# EAGLE schematic UCirKitUserStudyTest (EAGLE 7.3.0)
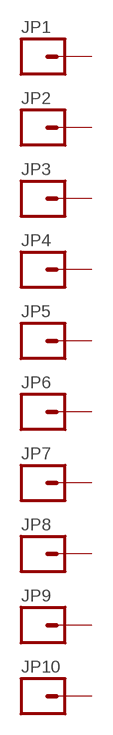
[diagram p0: schematic, sheet 1]

## Parts
JP1  M01OVAL_PIN  [1X01_OVAL_PIN]
JP2  M01OVAL_PIN  [1X01_OVAL_PIN]
JP3  M01OVAL_PIN  [1X01_OVAL_PIN]
JP4  M01OVAL_PIN  [1X01_OVAL_PIN]
JP5  M01OVAL_PIN  [1X01_OVAL_PIN]
JP6  M01OVAL_PIN  [1X01_OVAL_PIN]
JP7  M01OVAL_PIN  [1X01_OVAL_PIN]
JP8  M01OVAL_PIN  [1X01_OVAL_PIN]
JP9  M01OVAL_PIN  [1X01_OVAL_PIN]
JP10  M01OVAL_PIN  [1X01_OVAL_PIN]
Unconnected: JP1.1 JP2.1 JP3.1 JP4.1 JP5.1 JP6.1 JP7.1 JP8.1 JP9.1 JP10.1

## Library data of the parts
JP1-JP10 = SparkFun-Connectors:M01: Header 1 Standard 1-pin 0.1" header. Use with straight break away headers (SKU : PRT-00116), right angle break away headers (PRT-00553), swiss pins (PRT-00743), machine pins (PRT-00117), and female headers (PRT-00115).